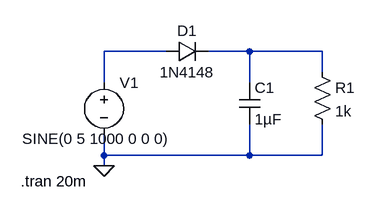
[diagram p0: schematic Lab6.asc]
Lab6.asc, the LTspice schematic file:
Version 4
SHEET 1 880 680
WIRE 208 80 112 80
WIRE 336 80 272 80
WIRE 448 80 336 80
WIRE 448 112 448 80
WIRE 112 128 112 80
WIRE 336 128 336 80
WIRE 112 240 112 208
WIRE 336 240 336 192
WIRE 336 240 112 240
WIRE 448 240 448 192
WIRE 448 240 336 240
WIRE 112 256 112 240
FLAG 112 256 0
SYMBOL voltage 112 112 R0
WINDOW 3 -126 102 Left 2
WINDOW 123 0 0 Left 0
WINDOW 39 0 0 Left 0
SYMATTR InstName V1
SYMATTR Value SINE(0 5 1000 0 0 0)
SYMBOL diode 208 96 R270
WINDOW 0 32 32 VTop 2
WINDOW 3 0 32 VBottom 2
SYMATTR InstName D1
SYMATTR Value 1N4148
SYMBOL cap 320 128 R0
SYMATTR InstName C1
SYMATTR Value 1µF
SYMBOL res 432 96 R0
SYMATTR InstName R1
SYMATTR Value 1k
TEXT -16 280 Left 2 !.tran 20m

The netlist it stands for:
* Lab6.asc
V1 N001 0 SINE(0 5 1000 0 0 0)
D1 N001 N002 1N4148
C1 N002 0 1µF
R1 N002 0 1k
.model D D
.lib standard.dio
.tran 20m
.backanno
.end